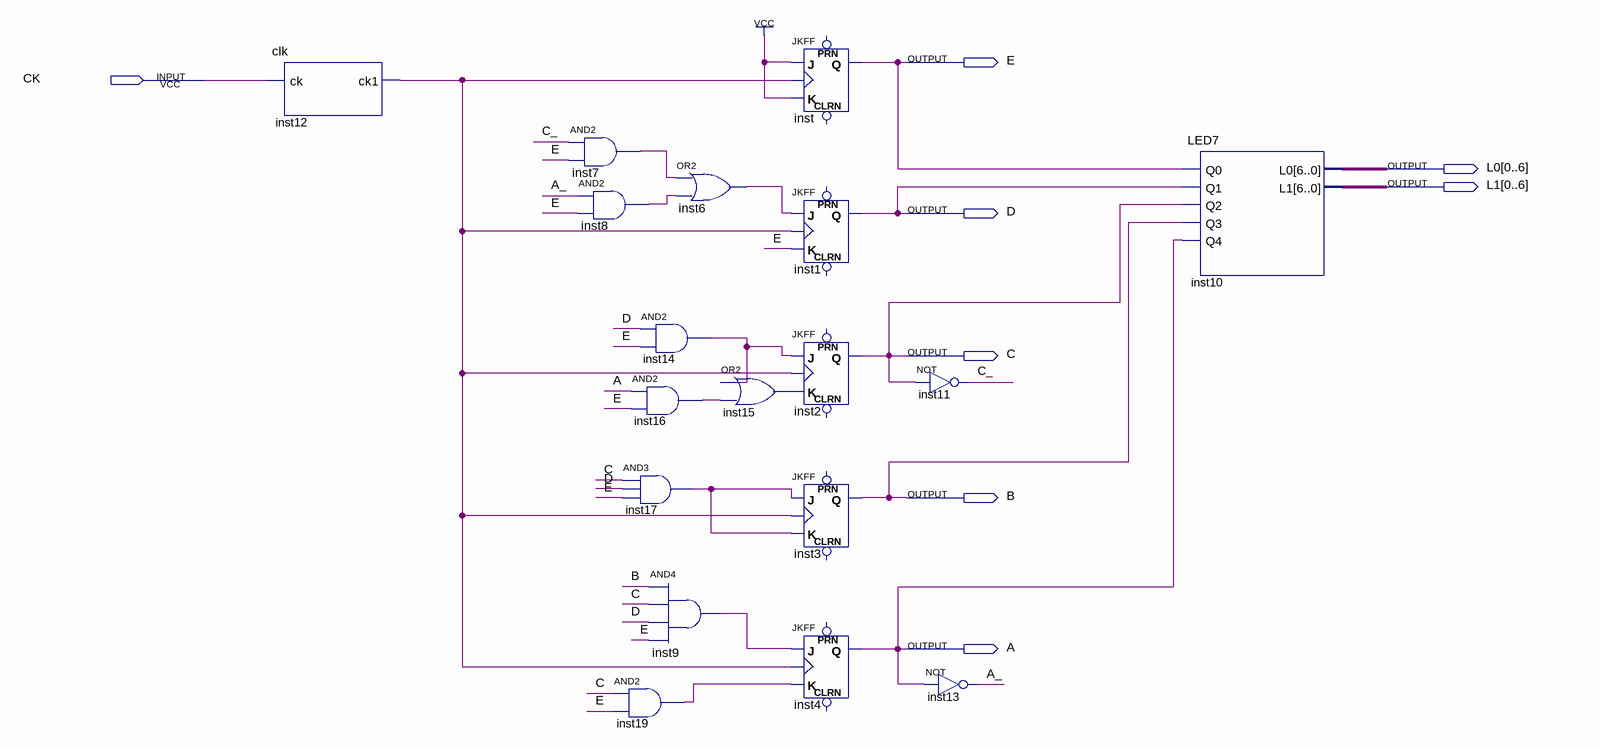
[diagram p0: schematic sheet]
// Quartus schematic work6_1.bdf as structural Verilog: 18 symbols, 8 pins
module work6_1 (
  input  CK,
  output E,
  output [0:6] L0,
  output [0:6] L1,
  output D,
  output C,
  output B,
  output A
);

  wire A_, C_, inst6_out, inst7_out, inst8_out, inst9_out, inst12_ck1, inst14_out, inst15_out, inst16_out,
       inst17_out, inst19_out;

  clk inst12 (.ck(CK), .ck1(inst12_ck1));
  and inst7 (inst7_out, C_, E);
  and inst8 (inst8_out, A_, E);
  and inst14 (inst14_out, D, E);
  and inst16 (inst16_out, A, E);
  and inst17 (inst17_out, C, D, E);
  and inst19 (inst19_out, C, E);
  or inst6 (inst6_out, inst7_out, inst8_out);
  and inst9 (inst9_out, B, C, D, E);
  or inst15 (inst15_out, inst14_out, inst16_out);
  JKFF inst (.K(1'b1), .J(1'b1), .CLK(inst12_ck1), .Q(E));  // open: PRN, CLRN
  JKFF inst1 (.K(E), .J(inst6_out), .CLK(inst12_ck1), .Q(D));  // open: PRN, CLRN
  JKFF inst2 (.K(inst15_out), .J(inst14_out), .CLK(inst12_ck1), .Q(C));  // open: PRN, CLRN
  JKFF inst3 (.K(inst17_out), .J(inst17_out), .CLK(inst12_ck1), .Q(B));  // open: PRN, CLRN
  JKFF inst4 (.K(inst19_out), .J(inst9_out), .CLK(inst12_ck1), .Q(A));  // open: PRN, CLRN
  not inst11 (C_, C);
  not inst13 (A_, A);
  LED7 inst10 (.Q0(E), .Q1(D), .Q2(C), .Q3(B), .Q4(A), .L0(L0), .L1(L1));
endmodule
